# Altium schematic sheet CAN_Isol_with_internal_dcdc_adm3053.SchDoc
size 420 x 297 mm
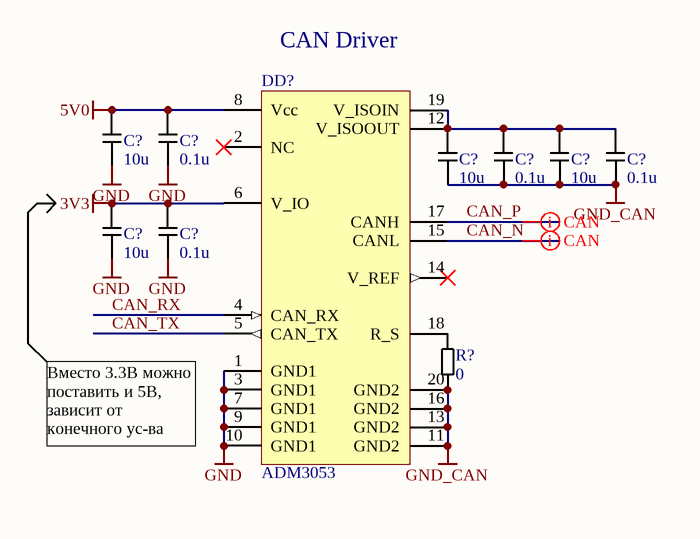
[diagram p0: CAN_Isol_with_internal_dcdc_adm3053.SchDoc]

## Parts
(Parts that share a designator on the sheet are numbered #1, #2 ... from top to bottom, then left to right.)
C?#1  10u  [C0603]
C?#2  0.1u  [C0603]
C?#3  10u  [C0603]
C?#4  0.1u  [C0603]
C?#5  10u  [C0603]
C?#6  0.1u  [C0603]
C?#7  10u  [C0603]
C?#8  0.1u  [C0603]
DD?  ADM3053  [SO-20W]
R?  0  [R0603]

## Nets
3V3: C?#7.1 C?#8.1 DD?.6(V_IO)
5V0: C?#1.1 C?#2.1 DD?.8(Vcc)
GND: C?#1.2 C?#2.2 C?#7.2 C?#8.2 DD?.1(GND1) DD?.3(GND1) DD?.7(GND1) DD?.9(GND1) DD?.10(GND1)
GND_CAN: C?#3.2 C?#4.2 C?#5.2 C?#6.2 DD?.11(GND2) DD?.13(GND2) DD?.16(GND2) DD?.20(GND2) R?.2
CAN_N: DD?.15(CANL)
CAN_P: DD?.17(CANH)
CAN_RX: DD?.4(CAN_RX)
CAN_TX: DD?.5(CAN_TX)
NetC?#3_1: C?#3.1 C?#4.1 C?#5.1 C?#6.1 DD?.12(V_ISOOUT) DD?.19(V_ISOIN)
NetDD?_18: DD?.18(R_S) R?.1

Not connected (* = marked no-connect by the designer): DD? 2(NC)* 14(V_REF)*

## Layout directives
differential pair: CAN_N, CAN_P

## Notes on the sheet
- (near DD?) CAN Driver
- (near DD?) Вместо 3.3В можно поставить и 5В, зависит от конечного ус-ва

## Library data of the parts
C?#1-C?#8 = C: Capacitor
DD? = ADM3053: Isolated CAN transceiver with isolated DC-DC
R? = R: Resistor